# Altium project jibo.PrjPcb
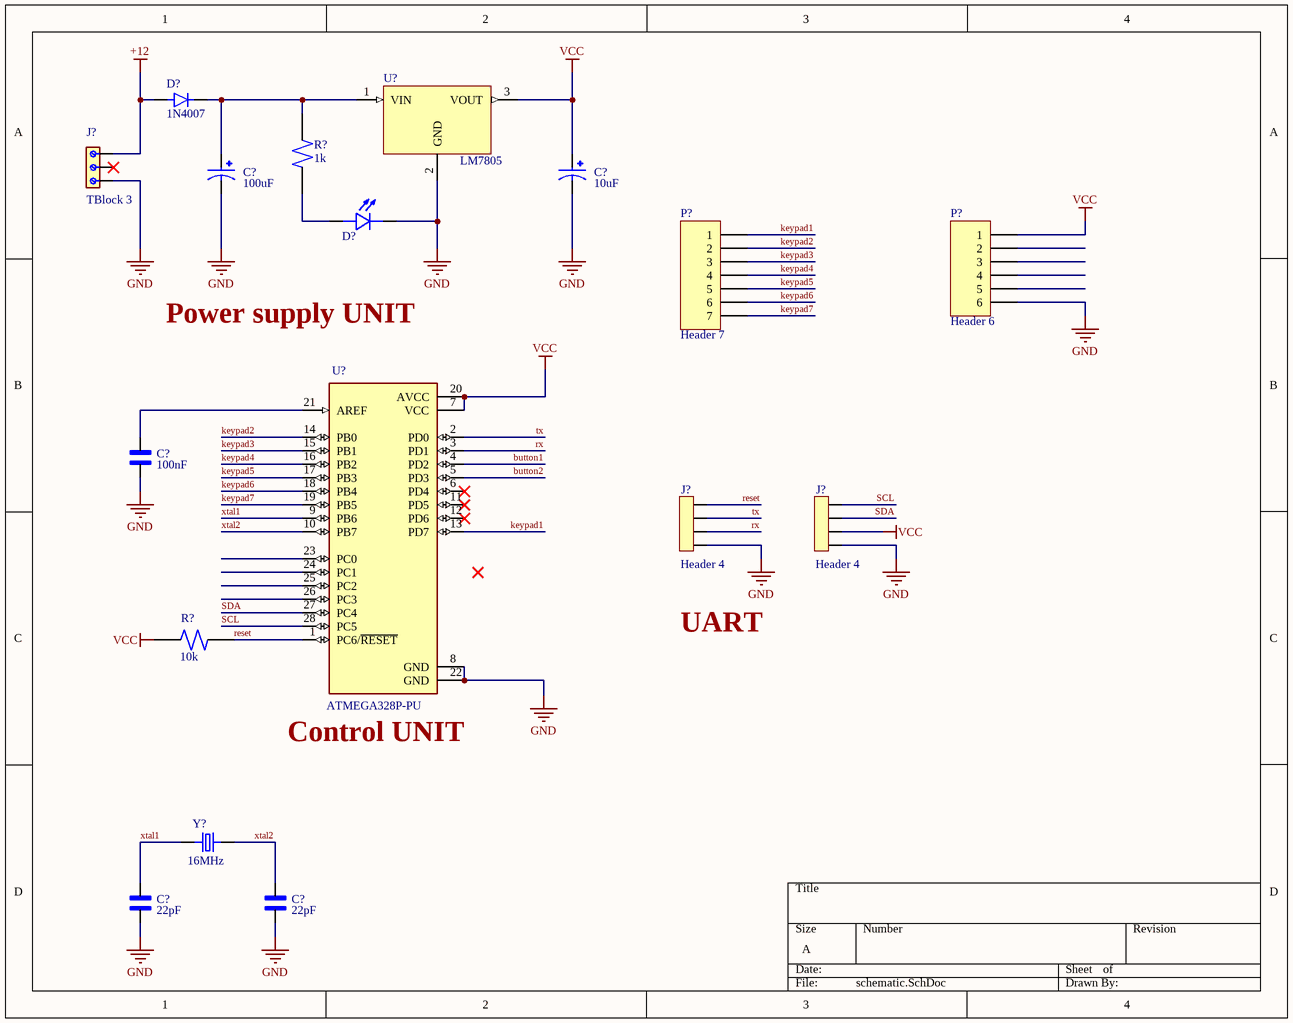
[diagram p0: schematic.SchDoc]
1 sheet, 17 parts. Net scope: global (net labels, ports and power ports of the same name join across sheets).

## Sheet schematic.SchDoc
size A; SheetNumber: 1; SheetTotal: 1

### Parts
(Parts that share a designator on the sheet are numbered #1, #2 ... from top to bottom, then left to right.)
C?#1  100uF  [CAPPRD500W50D500H1100]
C?#2  10uF  [CAPPRD500W50D500H1100]
C?#3  100nF  [CAPRB500W50L450T300H550]
C?#4  22pF  [CAPRB500W50L450T300H550]
C?#5  22pF  [CAPRB500W50L450T300H550]
D?#1  1N4007  [DIOAD1060W80L520D270]
D?#2  L08R5000Q1  [LEDRD254W57D500H1070]  (value not drawn)
J?#1  TBlock 3  [Terminal block - 3Pins]
J?#2  Header 4  [SULLINS_PPTC041LFBN-RC]
J?#3  Header 4  [SULLINS_PPTC041LFBN-RC]
P?#1  Header 7  [HDR1X7]
P?#2  Header 6  [HDR1X6]
R?#1  1k  [RESAD1100W55L680D260]
R?#2  10k  [RESAD1100W55L680D260]
U?#1  LM7805  [TO255P1020X450X1968-3]
U?#2  ATMEGA328P-PU  [DIP794W46P254L2967H457Q28B]
Y?  16MHz  [XTAL_ECS-160-20-4X]

### Nets
+12: D?#1.A J?#1.3
GND: C?#1.N C?#2.N C?#3.2 C?#4.2 C?#5.2 D?#2.C J?#1.1 J?#2.4 J?#3.4 P?#2.6 U?#1.2(GND) U?#2.8(GND) U?#2.22(GND)
VCC: C?#2.P J?#3.3 P?#2.1 R?#2.1 U?#1.3(VOUT) U?#2.7(VCC) U?#2.20(AVCC)
button1: U?#2.4(PD2)
button2: U?#2.5(PD3)
keypad1: P?#1.1 U?#2.13(PD7)
keypad2: P?#1.2 U?#2.14(PB0)
keypad3: P?#1.3 U?#2.15(PB1)
keypad4: P?#1.4 U?#2.16(PB2)
keypad5: P?#1.5 U?#2.17(PB3)
keypad6: P?#1.6 U?#2.18(PB4)
keypad7: P?#1.7 U?#2.19(PB5)
reset: J?#2.1 R?#2.2 U?#2.1(PC6/~{RESET})
rx: J?#2.3 U?#2.3(PD1)
SCL: J?#3.1 U?#2.28(PC5)
SDA: J?#3.2 U?#2.27(PC4)
tx: J?#2.2 U?#2.2(PD0)
xtal1: C?#4.1 U?#2.9(PB6) Y?.1
xtal2: C?#5.1 U?#2.10(PB7) Y?.2
NetC?#1_P: C?#1.P D?#1.C R?#1.2 U?#1.1(VIN)
NetC?#3_1: C?#3.1 U?#2.21(AREF)
NetD?#2_A: D?#2.A R?#1.1

Not connected (* = marked no-connect by the designer): J?#1 2*; P?#2 2 3 4 5; U?#2 6(PD4)* 11(PD5)* 12(PD6)* 23(PC0) 24(PC1) 25(PC2) 26(PC3)

### Notes on the sheet
- Power supply UNIT
- UART
- (near U?#2) Control UNIT

### Library data of the parts
C?#1 C?#2 = Electrolytic capacitor: FS-A; MF: {'manufacturer': u'Panasonic'}; MP: EEUFS0J221B; Package: None; Value: *; Availability: Unavailable; Price: None
C?#3-C?#5 = Ceramic capacitor: 2200 pF Â±10% 250V Ceramic Capacitor X7R Radial; MF: TDK; MP: FG24X7R2E222KNT06; Digi-Key_Part_Number: 445-173386-1-ND; Purchase-URL: https://pricing.snapeda.com/search/part/FG24X7R2E222KNT06/?ref=eda; Check_prices: https://www.snapeda.com/parts/FG24X7R2E222KNT06/TDK/view-part/?ref=eda; Value: *; Package: Radial TDK; SnapEDA_Link: https://www.snapeda.com/parts/FG24X7R2E222KNT06/TDK/view-part/?ref=snap
D?#1 = 1N4007: Diode Switching 1KV 1A 2-Pin DO-41; Price: None; MP: 1N4007; Value: *; Availability: Unavailable; Package: None
D?#2 = LED: LED, Orange, Through Hole, T-1 3/4 (5mm), 30 mA, 2.1 V, 635 nm; MF: {'manufacturer': u'LED Technology'}; Price: None; Package: None; Availability: Unavailable; MP: L08R5000Q1; Value: *
J?#1 = 3Pins Terminal block: 5.08 MM TERMINAL BLOCK;; MP: 691216510003S; MF: Wurth Electronics; Package: None; Purchase-URL: https://pricing.snapeda.com/search/part/691216510003S/?ref=eda; Check_prices: https://www.snapeda.com/parts/691216510003S/Wurth+Electronics+Inc/view-part/?ref=eda; Availability: In Stock; Price: None; SnapEDA_Link: https://www.snapeda.com/parts/691216510003S/Wurth+Electronics+Inc/view-part/?ref=snap; Value: *
J?#2 J?#3 = Female header - 4Pins: 4 Position Header Connector Through Hole; MP: PPTC041LFBN-RC; MF: Sullins Connector; Value: *; SnapEDA_Link: https://www.snapeda.com/parts/PPTC041LFBN-RC/Sullins%20Connector%20Solutions/view-part/285917/?ref=snap; Package: None; Availability: Warning; Check_prices: https://www.snapeda.com/parts/PPTC041LFBN-RC/Sullins%20Connector%20Solutions/view-part/285917/?ref=eda; Price: None; Purchase-URL: https://pricing.snapeda.com/search/part/PPTC041LFBN-RC/?ref=eda
P?#1 = Header 7: Header, 7-Pin; LatestRevisionDate: 17-Jul-2002; LatestRevisionNote: Re-released for DXP Platform.; Publisher: Altium Limited
P?#2 = Header 6: Header, 6-Pin; LatestRevisionDate: 17-Jul-2002; LatestRevisionNote: Re-released for DXP Platform.; Publisher: Altium Limited
R?#1 R?#2 = Resistor (0.25W): (MFR-25FBF52-10K) 10,2 kOhm bei 1% 0,25W, 1/4W Durchbohrlochwiderstand Axial Metal Film; MF: Yageo; Digi-Key_Part_Number: 10.2KXBK-ND; SnapEDA_Link: https://www.snapeda.com/parts/MFR-25FBF52-10K/Yageo/view-part/424333/?ref=snap; Package: Axial Yageo; Purchase-URL: https://pricing.snapeda.com/search/part/MFR-25FBF52-10K/?ref=eda; MP: MFR-25FBF52-10K; Value: *
U?#1 = LM78__: MP: LM7805CT/NOPB; Price: None; Value: *; Availability: Unavailable; Package: None
U?#2 = ATMEGA328P-PU: ATmega Series 20 MHz 32 KB Flash 2 KB SRAM 8-Bit Microcontroller - DIP-28; Value: *; MP: ATMEGA328P-PU; Package: None; Availability: Unavailable; Price: None
Y? = Crystal oscilator: CRYSTAL T/H; MF: {'manufacturer': u'ECS Inc.'}; MP: ECS-160-S-4; Package: None; Value: *; Availability: Unavailable; Price: None